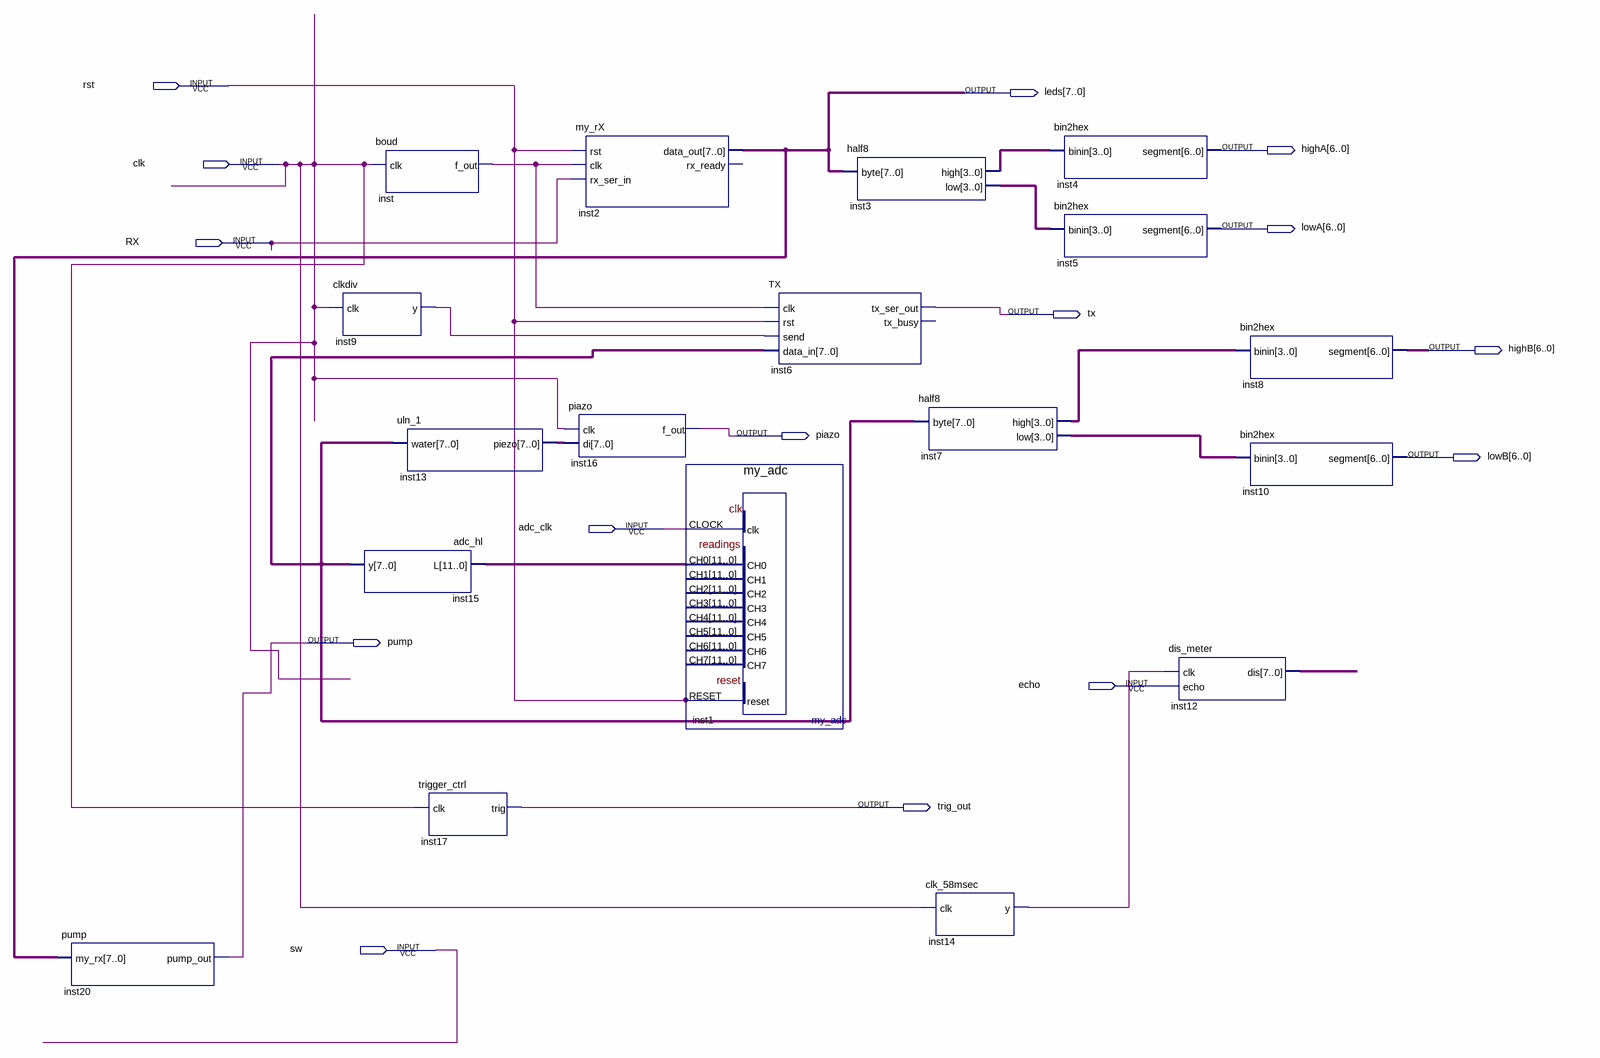
[diagram p0: schematic sheet]
// Quartus schematic rxtx.bdf as structural Verilog: 18 symbols, 15 pins
module rxtx (
  input  rst,
  input  clk,
  input  RX,
  input  adc_clk,
  input  echo,
  input  sw,
  output [7:0] leds,
  output [6:0] highA,
  output [6:0] lowA,
  output tx,
  output [6:0] highB,
  output piazo,
  output [6:0] lowB,
  output pump,
  output trig_out
);

  wire inst9_y, inst14_y, inst_f_out;
  wire [3:0] inst3_high, inst3_low, inst7_high, inst7_low;
  wire [7:0] inst12_dis, inst13_piezo, inst15_y;
  wire [11:0] inst1_ch0;

  pump inst20 (.my_rx(leds), .pump_out(pump));
  clkdiv inst9 (.clk(clk), .y(inst9_y));
  adc_hl inst15 (.L(inst1_ch0), .y(inst15_y));
  boud inst (.clk(clk), .f_out(inst_f_out));
  uln_1 inst13 (.water(inst15_y), .piezo(inst13_piezo));
  trigger_ctrl inst17 (.clk(clk), .trig(trig_out));
  my_rX inst2 (.rst(rst), .clk(inst_f_out), .rx_ser_in(RX), .data_out(leds));  // open: rx_ready
  piazo inst16 (.clk(clk), .di(inst13_piezo), .f_out(piazo));
  my_adc inst1 (.CLOCK(adc_clk), .RESET(rst), .CH0(inst1_ch0));  // open: CH1, CH2, CH3, CH4, CH5, CH6, CH7
  TX inst6 (.clk(inst_f_out), .rst(rst), .send(inst9_y), .data_in(inst15_y), .tx_ser_out(tx));  // open: tx_busy
  half8 inst3 (.\byte (leds), .high(inst3_high), .low(inst3_low));
  half8 inst7 (.\byte (inst15_y), .high(inst7_high), .low(inst7_low));
  clk_58msec inst14 (.clk(clk), .y(inst14_y));
  bin2hex inst4 (.binin(inst3_high), .segment(highA));
  bin2hex inst5 (.binin(inst3_low), .segment(lowA));
  dis_meter inst12 (.clk(inst14_y), .echo(echo), .dis(inst12_dis));
  bin2hex inst8 (.binin(inst7_high), .segment(highB));
  bin2hex inst10 (.binin(inst7_low), .segment(lowB));
endmodule
